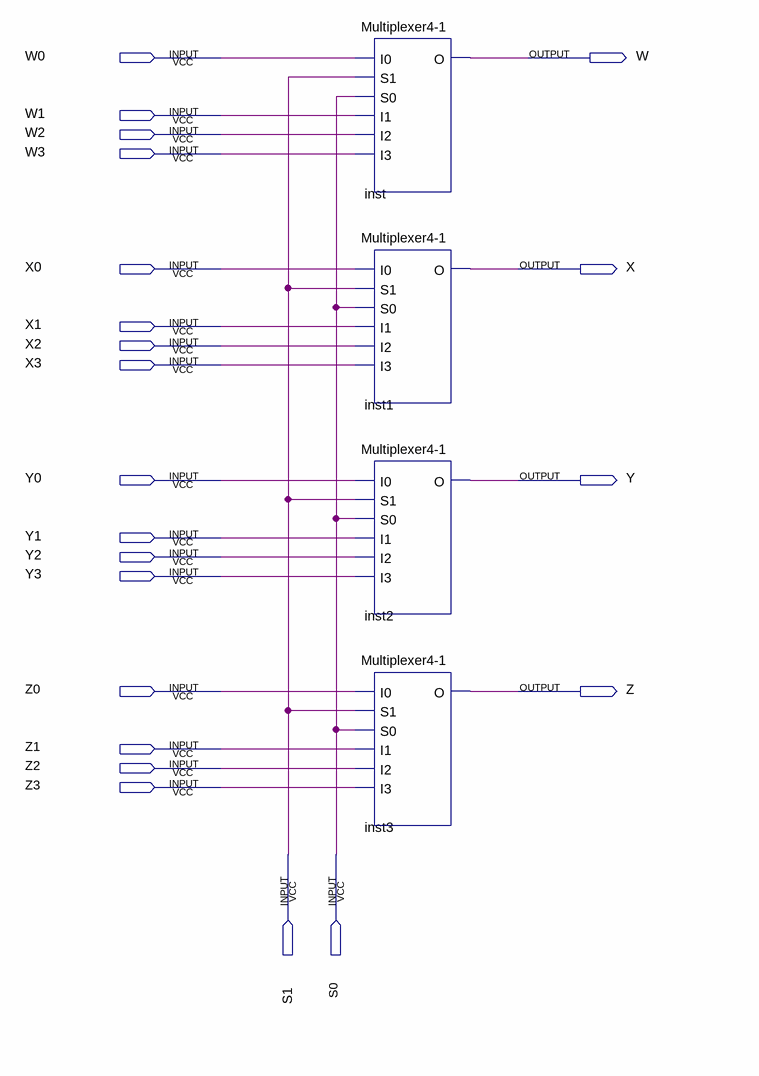
[diagram p0: schematic sheet]
// Quartus schematic Quad4to1Multiplexer.bdf as structural Verilog: 4 symbols, 22 pins
module Quad4to1Multiplexer (
  input  W0,
  input  W1,
  input  W2,
  input  W3,
  input  X0,
  input  X1,
  input  X2,
  input  X3,
  input  Y0,
  input  Y1,
  input  Y2,
  input  Y3,
  input  Z0,
  input  Z1,
  input  Z2,
  input  Z3,
  input  S1,
  input  S0,
  output W,
  output X,
  output Y,
  output Z
);

  \Multiplexer4-1  inst (.I0(W0), .S1(S1), .S0(S0), .I1(W1), .I2(W2), .I3(W3), .O(W));
  \Multiplexer4-1  inst1 (.I0(X0), .S1(S1), .S0(S0), .I1(X1), .I2(X2), .I3(X3), .O(X));
  \Multiplexer4-1  inst2 (.I0(Y0), .S1(S1), .S0(S0), .I1(Y1), .I2(Y2), .I3(Y3), .O(Y));
  \Multiplexer4-1  inst3 (.I0(Z0), .S1(S1), .S0(S0), .I1(Z1), .I2(Z2), .I3(Z3), .O(Z));
endmodule
